# EAGLE design receiver_lify (EAGLE 7.6.0)
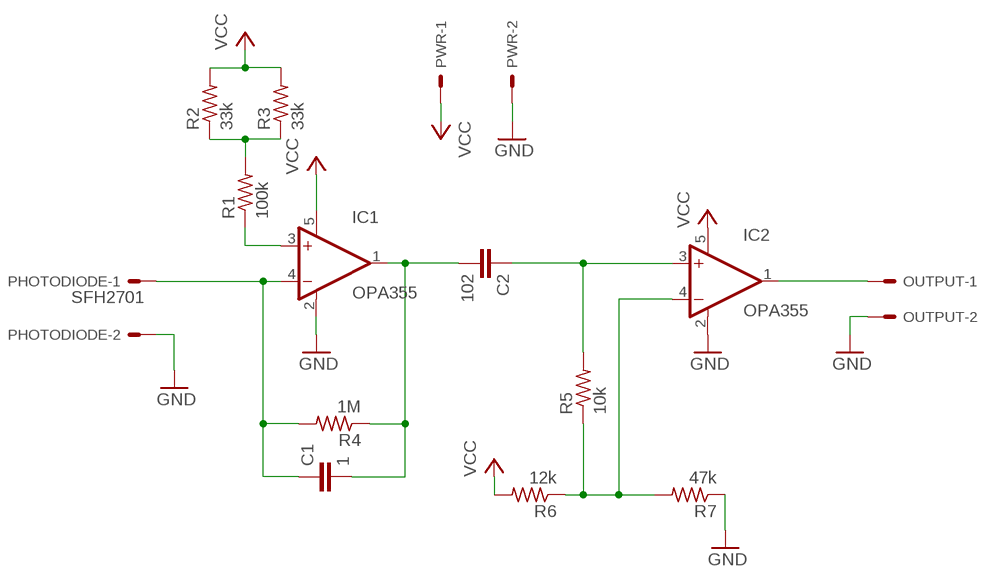
[diagram p0: schematic, sheet 1]

## Parts
C1  1  C-EU050-025X075  [C050-025X075]
C2  102  C-EU050-025X075  [C050-025X075]
IC1  OPA355  OPA658N  [SOT23-5]
IC2  OPA355  OPA658N  [SOT23-5]
OUTPUT  22-23-2021  [22-23-2021]
PHOTODIODE  SFH2701  22-23-2021  [22-23-2021]
PWR  22-23-2021  [22-23-2021]
R1  100k  R-US_0204/7  [0204/7]
R2  33k  R-US_0204/7  [0204/7]
R3  33k  R-US_0204/7  [0204/7]
R4  1M  R-US_0204/7  [0204/7]
R5  10k  R-US_0204/7  [0204/7]
R6  12k  R-US_0204/7  [0204/7]
R7  47k  R-US_0204/7  [0204/7]

## Nets
GND: IC1.2(V-) IC2.2(V-) OUTPUT.2 PHOTODIODE.2 PWR.2 R7.1
N$1: C1.1 IC1.4(-IN) PHOTODIODE.1 R4.2
N$2: IC1.3(+IN) R1.1
N$3: R1.2 R2.1 R3.1
N$4: C1.2 C2.2 IC1.1(OUT) R4.1
N$5: IC2.4(-IN) R5.1 R6.1 R7.2
N$6: C2.1 IC2.3(+IN) R5.2
N$8: IC2.1(OUT) OUTPUT.1
VCC: IC1.5(V+) IC2.5(V+) PWR.1 R2.2 R3.2 R6.2

## Library data of the parts
C1 C2 = resistor:C-EU: CAPACITOR, European symbol
IC1 IC2 = burr-brown:OPA658: Operational Amplifier Wideband, Low Power, Current Feedback; OC_FARNELL: unknown; OC_NEWARK: unknown
OUTPUT PHOTODIODE PWR = con-molex:22-23-2021: .100" (2.54mm) Center Header - 2 Pin; MF: MOLEX; MPN: 22-23-2021; OC_FARNELL: 1462926; OC_NEWARK: 25C3832
R1-R7 = resistor:R-US_: RESISTOR, American symbol

## Board
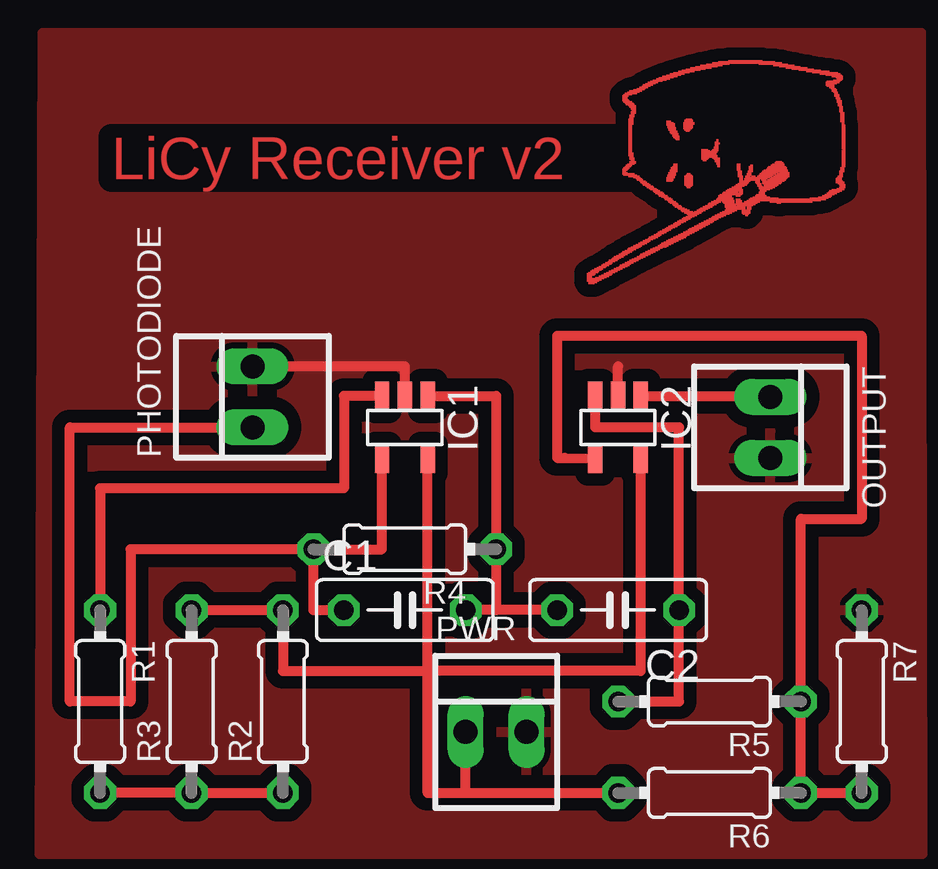
[diagram p1: board, top side]

No outline drawn. Coordinates in mm, seen from the top.
Copper layers (1*16): Top 0.035mm / dielectric 1.5mm / Bottom 0.035mm
Design rules "default": minimum track width 10mil, minimum drill 24mil, track to track 8mil, track to pad 8mil, pad to pad 8mil, via to via 8mil, smd to smd 8mil, copper to edge 40mil, drill to drill 8mil, minimum pad ring 10mil, minimum via ring 8mil, stop-mask expansion 4mil, vias tented up to drill 0mil, thermal gap 10mil

### Footprints (pad centres in the part's own frame; a part is rotated, then mirrored left to right if it is on the bottom)
C050-025X075 = drill 0.813 octagon: 1 -2.54,0; 2 2.54,0
SOT23-5 = smd 0.6 x 1.2: 1 -0.95,-1.306; 2 0,-1.306; 3 0.95,-1.306; 4 0.95,1.306; 5 -0.95,1.306
22-23-2021 = drill 1 long: 1 -1.27,0; 2 1.27,0
0204/7 = drill 0.813 octagon: 1 -3.81,0; 2 3.81,0

### Placement (x,y rotation side)
C1  38.1,45.72 0 top
C2  46.99,45.72 180 top
IC1  38.1,53.34 180 top
IC2  46.99,53.34 180 top
OUTPUT  53.34,53.34 270 top
PHOTODIODE  31.75,54.61 90 top
PWR  41.91,40.64 0 top
R1  25.4,41.91 270 top
R2  33.02,41.91 90 top
R3  29.21,41.91 90 top
R4  38.1,48.26 180 top
R5  50.8,41.91 180 top
R6  50.8,38.1 180 top
R7  57.15,41.91 270 top

### Tracks (layer width: path | path; a pad name or v marks a point on that pad's centre or on a via)
GND
  Top 0.406: IC1.2 38.1,55.88 PHOTODIODE.2 | IC2.2 46.99,55.88
  pour Top (isolate 0.533): 22.99,69.77 22.86,35.56 59.69,35.56 59.64,69.77
N$1
  Top 0.406: R4.2 37.15,48.26 IC1.4 | R4.2 26.67,48.26 26.67,41.91 24.13,41.91 24.13,53.34 PHOTODIODE.1 | R4.2 34.29,45.72 C1.1
N$2
  Top 0.406: IC1.3 35.56,54.65 35.56,50.8 25.4,50.8 R1.1
N$3
  Top 0.406: R1.2 R3.1 R2.1
N$4
  Top 0.406: IC1.1 41.91,54.65 R4.1 41.91,45.72 | C2.2 41.91,45.72 | 41.91,45.72 C1.2
N$5
  Top 0.406: R7.2 R6.1 R5.1 54.61,49.53 57.15,49.53 57.15,57.15 44.45,57.15 44.45,52.07 44.77,52.07 IC2.4
N$6
  Top 0.406: R5.2 49.53,41.91 C2.1 49.53,53.34 46.04,53.34 IC2.3
N$8
  Top 0.406: IC2.1 52.07,54.65 OUTPUT.1
VCC
  Top 0.406: R3.2 R2.2 33.02,43.18 39.05,43.18 | 39.05,43.18 IC1.5 | 39.05,43.18 39.05,38.1 40.64,38.1 | 39.05,43.18 47.94,43.18 IC2.5 | 40.64,38.1 PWR.1 | 40.64,38.1 R6.2
(copper drawn outside any net)
  shapes: Top area x713

### Text on the board
Top: LiCy Receiver v2